# EAGLE design adapter (EAGLE 9.3.0)
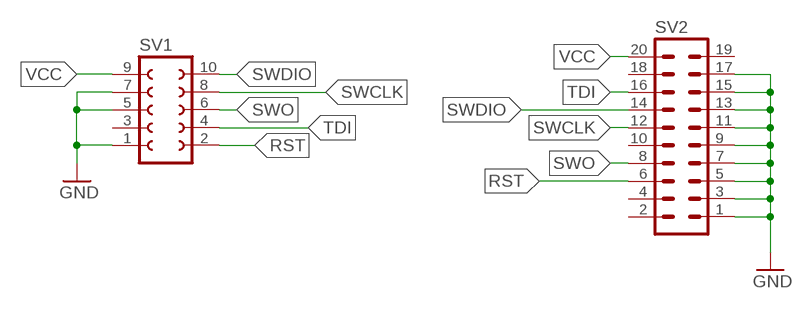
[diagram p0: schematic, sheet 1]

## Parts
SV1  FE05-2W  [FE05-2W]
SV2  MA10-2  [MA10-2]

## Nets
GND: SV1.1 SV1.5 SV1.7 SV2.1 SV2.3 SV2.5 SV2.7 SV2.9 SV2.11 SV2.13 SV2.15 SV2.17
RST: SV1.2 SV2.6
SWCLK: SV1.8 SV2.12
SWDIO: SV1.10 SV2.14
SWO: SV1.6 SV2.8
TDI: SV1.4 SV2.16
VCC: SV1.9 SV2.20
Unconnected: SV1.3 SV2.2 SV2.4 SV2.10 SV2.18 SV2.19

## Library data of the parts
SV1 = con-lsta:FE05-2W: FEMALE HEADER; OC_FARNELL: unknown; OC_NEWARK: unknown
SV2 = con-lstb:MA10-2: PIN HEADER; OC_FARNELL: unknown; OC_NEWARK: unknown

## Board
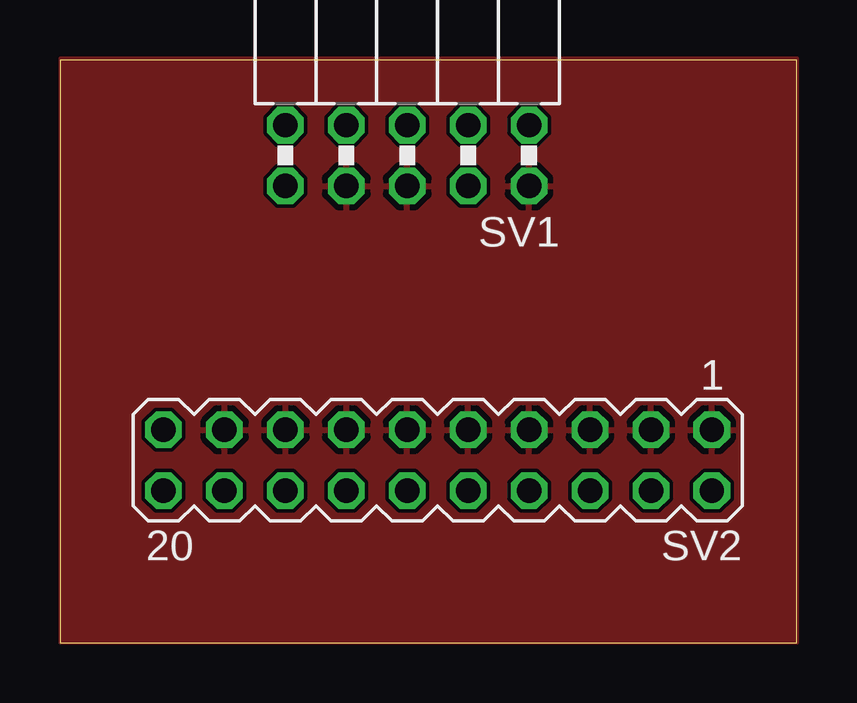
[diagram p1: board, top side]
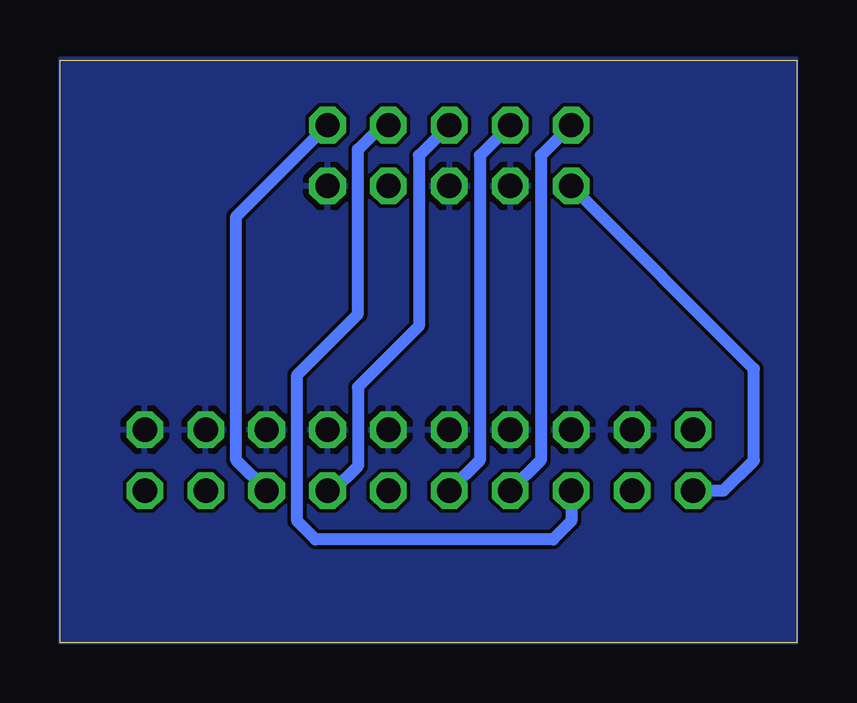
[diagram p2: board, bottom side, seen from below]

Size 30.71 x 24.31 mm. Coordinates in mm from the lower left corner, seen from the top.
Outline: 0,0 30.71,0 30.71,24.31 0,24.31 0,0
Copper layers (1*16): Top 0.035mm / dielectric 1.5mm / Bottom 0.035mm
Design rules "default *": minimum track width 20mil, minimum drill 0.35mm, track to track 6mil, track to pad 6mil, pad to pad 6mil, via to via 6mil, smd to smd 6mil, copper to edge 0mil, drill to drill 6mil, minimum pad ring 10mil, minimum via ring 8mil, stop-mask expansion 4mil, vias tented up to drill 0mil, thermal gap 10mil

### Footprints (pad centres in the part's own frame; a part is rotated, then mirrored left to right if it is on the bottom)
FE05-2W = drill 1.016 octagon: 1 -5.08,1.27; 2 -5.08,-1.27; 3 -2.54,1.27; 4 -2.54,-1.27; 5 0,1.27; 6 0,-1.27; 7 2.54,1.27; 8 2.54,-1.27; 9 5.08,1.27; 10 5.08,-1.27
MA10-2 = drill 1.016 octagon: 1 -11.43,-1.27; 2 -11.43,1.27; 3 -8.89,-1.27; 4 -8.89,1.27; 5 -6.35,-1.27; 6 -6.35,1.27; 7 -3.81,-1.27; 8 -3.81,1.27; 9 -1.27,-1.27; 10 -1.27,1.27; 11 1.27,-1.27; 12 1.27,1.27; 13 3.81,-1.27; 14 3.81,1.27; 15 6.35,-1.27; 16 6.35,1.27; 17 8.89,-1.27; 18 8.89,1.27; 19 11.43,-1.27; 20 11.43,1.27

### Placement (x,y rotation side)
SV1  14.48,20.32 180 top
SV2  15.75,7.62 180 top

### Tracks (layer width: path | path; a pad name or v marks a point on that pad's centre or on a via)
GND
  pour Top: 0,0 0,24.38 30.73,24.38 30.73,0
  pour Bottom: 0,24.38 30.73,24.38 30.73,0 0,0
RST
  Bottom 0.508: SV2.6 23.37,7.62 23.37,17.78 SV1.2
SWCLK
  Bottom 0.508: SV1.8 13.21,20.32 13.21,7.62 SV2.12
SWDIO
  Bottom 0.508: SV1.10 10.67,20.32 10.67,7.62 SV2.14
SWO
  Bottom 0.508: SV1.6 15.75,20.32 15.75,13.21 18.29,10.67 18.29,7.37 19.3,6.35 SV2.8
TDI
  Bottom 0.508: SV2.16 9.4,5.08 10.16,4.32 20.07,4.32 20.83,5.08 20.83,11.18 18.29,13.72 18.29,20.57 17.27,21.59 SV1.4
VCC
  Bottom 0.508: SV2.20 3.05,6.35 1.78,7.62 1.78,11.43 SV1.9